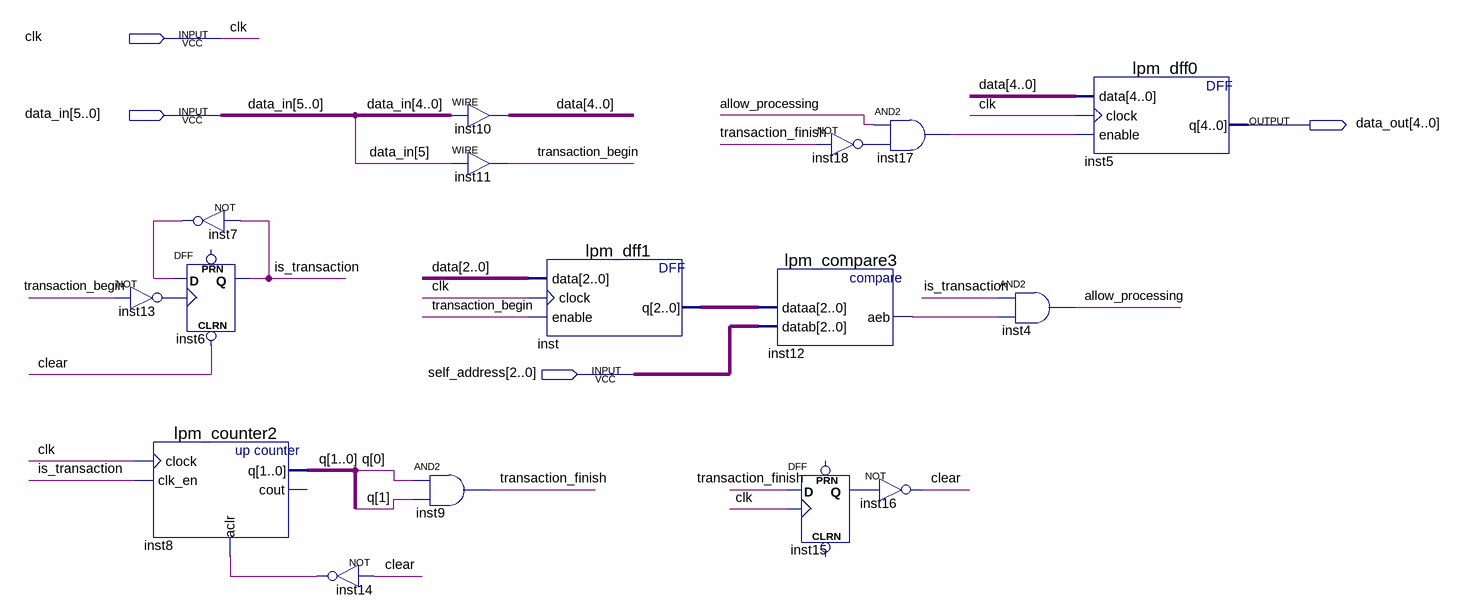
[diagram p0: schematic sheet]
// Quartus schematic SlaveDevice.bdf as structural Verilog: 16 symbols, 4 pins
module SlaveDevice (
  input  clk,
  input  [5:0] data_in,
  input  [2:0] self_address,
  output [4:0] data_out
);

  wire allow_processing, clear, inst7_out, inst12_aeb, inst13_out, inst14_out, inst15_q, inst17_out,
       inst18_out, is_transaction, transaction_begin, transaction_finish;
  wire [1:0] q;
  wire [2:0] inst_q;
  wire [4:0] data;

  not inst13 (inst13_out, transaction_begin);
  lpm_counter2 inst8 (.clock(clk), .clk_en(is_transaction), .aclr(inst14_out), .q(q));  // open: cout
  not inst7 (inst7_out, is_transaction);
  DFF inst6 (.CLRN(clear), .CLK(inst13_out), .D(inst7_out), .Q(is_transaction));  // open: PRN
  not inst14 (inst14_out, clear);
  assign data = data_in[4:0];  // WIRE inst10
  assign transaction_begin = data_in[5];  // WIRE inst11
  and inst9 (transaction_finish, q[0], q[1]);
  lpm_dff1 inst (.data(data[2:0]), .clock(clk), .enable(transaction_begin), .q(inst_q));
  lpm_compare3 inst12 (.dataa(inst_q), .datab(self_address), .aeb(inst12_aeb));
  not inst18 (inst18_out, transaction_finish);
  DFF inst15 (.CLK(clk), .D(transaction_finish), .Q(inst15_q));  // open: CLRN, PRN
  and inst17 (inst17_out, allow_processing, inst18_out);
  not inst16 (clear, inst15_q);
  and inst4 (allow_processing, is_transaction, inst12_aeb);
  lpm_dff0 inst5 (.data(data), .clock(clk), .enable(inst17_out), .q(data_out));
endmodule
